# EasyEDA Pro project Modular-Analog-Synthesizer.eprj, schematic Schematic1
Board Name: sequencer; Create Date: 2026-03-14; Page Name: sequencer-circuit; Project Name: Modular-Analog-Synthesizer; Schematic Name: Schematic1; Update Date: 2026-04-13; Company: EasyEDA.com; Page Size: A4; Version: V1.0
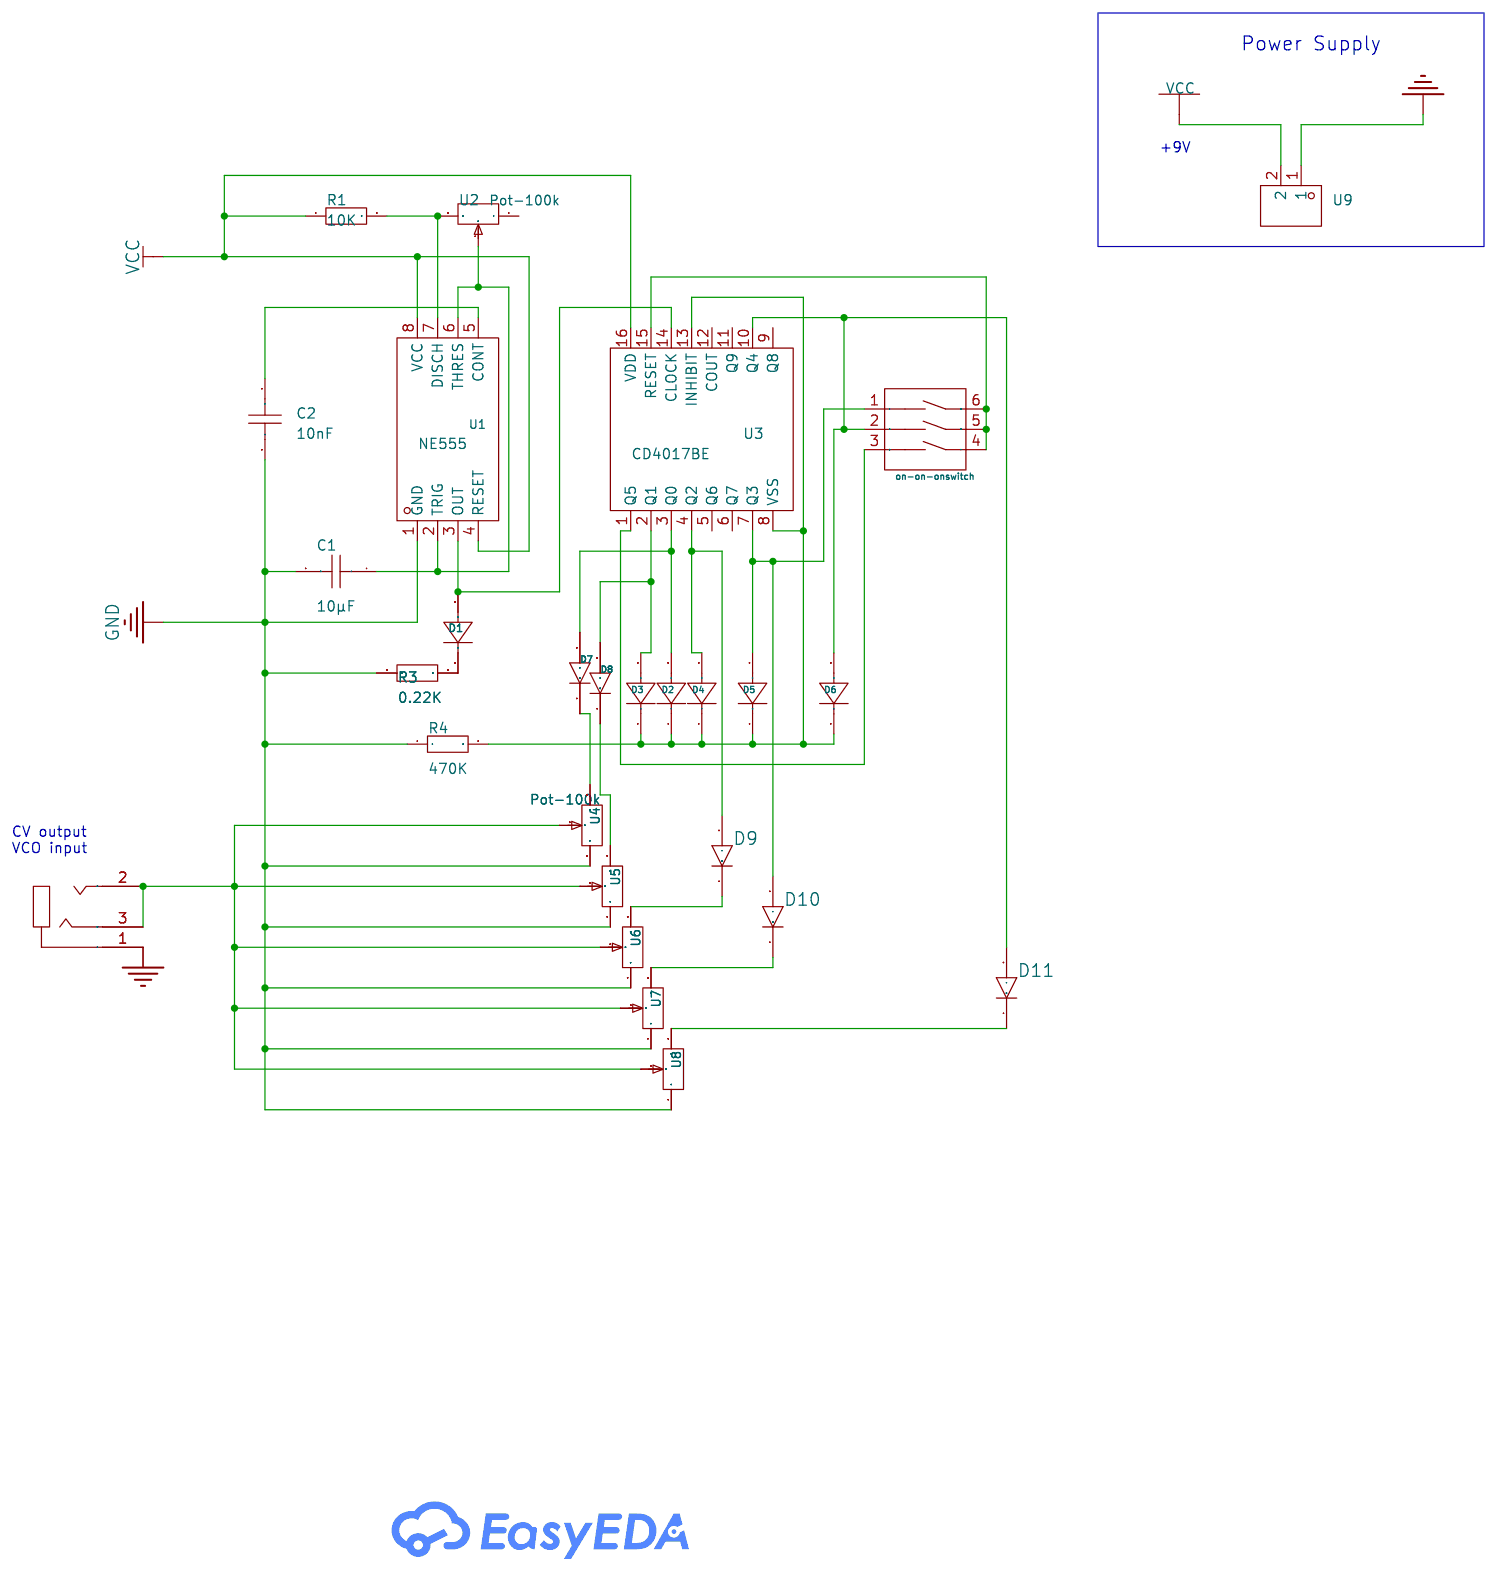
[diagram p0: schematic sheet]

## Parts
C1  10µF  [C0603]
C2  10nF  [C0603]
CVoutput  -  [AUDIO-SMD_PJ-313D]
D1  -  [SMA_L4.4-W2.8-LS5.4-RD]
D2  -  [SMA_L4.4-W2.8-LS5.4-RD]
D3  -  [SMA_L4.4-W2.8-LS5.4-RD]
D4  -  [SMA_L4.4-W2.8-LS5.4-RD]
D5  -  [SMA_L4.4-W2.8-LS5.4-RD]
D6  -  [SMA_L4.4-W2.8-LS5.4-RD]
D7  -  [DO-41_BD2.4-L4.7-P8.70-D0.9-RD]
D8  -  [DO-41_BD2.4-L4.7-P8.70-D0.9-RD]
D9  -  [DO-41_BD2.4-L4.7-P8.70-D0.9-RD]
D10  -  [DO-41_BD2.4-L4.7-P8.70-D0.9-RD]
D11  -  [DO-41_BD2.4-L4.7-P8.70-D0.9-RD]
on-on-onswitch  ATE2D-2M3-10-Z  [SW-TH_ATE2D-2M3-10-Z]
R1  10K  [R0603]
R3  0.22K  [R0603]
R4  470K  [R0603]
U1  NE555  [SOIC-8_L4.9-W3.9-P1.27-LS6.0-BL]
U2  Pot-100k  [RES-ADJ-SMD_VG039NCH]
U3  CD4017BE  [DIP-16_L19.2-W6.6-P2.54-LS7.6-BL]
U4  Pot-100k  [RES-ADJ-SMD_VG039NCH]
U5  Pot-100k  [RES-ADJ-SMD_VG039NCH]
U6  Pot-100k  [RES-ADJ-SMD_VG039NCH]
U7  Pot-100k  [RES-ADJ-SMD_VG039NCH]
U8  Pot-100k  [RES-ADJ-SMD_VG039NCH]
U9  -  [CONN-TH_P5.00_KF301-5.0-2P]

## Library data of the parts
C1 C2 = CAP_0603: Supplier Footprint: 0603
CVoutput = PJ-313D-6A: LCSC Part Name: 3.5mm耳机座; Supplier Part: C95463; Manufacturer: 韩国韩荣; Supplier Footprint: SMD; JLCPCB Part Class: Extended Part; Datasheet: https://atta.szlcsc.com/upload/public/pdf/source/20191118/C95463_33C76E25D98A90BB88D1795912C97EA2.pdf; Supplier: LCSC; Connector Type: 3.5mm耳机座; Current Rating (Max): 500mA; Voltage Rating (Max): 30V
D1-D6 = 1N4007: Supplier Footprint: SMA(DO-214AC); Supplier Part: C727081
D7-D11 = 1N4007: LCSC Part Name: 1kV 1A 1.1V@1A; Supplier Part: C84641; Manufacturer: 星海; Supplier Footprint: DO-41; JLCPCB Part Class: Extended Part; Datasheet: https://atta.szlcsc.com/upload/public/pdf/source/20171026/C84641_15089842760411059271.pdf; Supplier: LCSC; Forward Voltage (Vf@If): 1.1V@1A; Reverse Leakage Current: 5μA@1kV
on-on-onswitch = ATE2D-2M3-10-Z: LCSC Part Name: 拨动开关; Supplier Part: C2921532; Manufacturer: NIDEC(尼得科); Supplier Footprint: 插件,9.5x5mm; JLCPCB Part Class: Extended Part; Datasheet: https://item.szlcsc.com/datasheet/ATE2D-2M3-10-Z/3230384.html; Supplier: LCSC; Circuit: DPDT; Length: 9.5mm; Width: 5mm; Switch Height: 18mm; Life: 50,000 Cycles; Current Rating: 50mA; Voltage Rating (AC): 60V; Actuator Type: Cylinder Lever; Termination Style: Gull Wing; Mounting Type: Through Hole; Operating Temperature: -20℃~+85℃
R1 R3 R4 = Res_0603: Supplier Footprint: 0603
U1 = NE555_C5125085: Supplier Part: C5125085; Manufacturer: IDCHIP(英锐芯); Supplier Footprint: SOP-8; JLCPCB Part Class: Extended Part; Datasheet: https://item.szlcsc.com/datasheet/NE555/5722226.html; Supplier: LCSC
U2 U4-U8 = 3*3Potentiometer-10kΩ20%: Supplier Part: C9900010776; Supplier Footprint: SMD-3P; JLCPCB Part Class: Extended Part; Supplier: LCSC
U3 = CD4017BE: LCSC Part Name: 具有 10 个解码输出的 CMOS 十进制计数器; Supplier Part: C507168; Manufacturer: HGSEMI(华冠); Supplier Footprint: DIP-16; JLCPCB Part Class: Extended Part; Datasheet: https://item.szlcsc.com/datasheet/CD4017BE/520606.html; Supplier: LCSC; Voltage - Supply: 3V~18V; Trigger Type: Rising Edge; Reset: Asynchronous; Count Rate: 5.5MHz; Operating Temperature: -40℃~+85℃; Propagation Delay: 85ns
U9 = KF301-5.0-2P: LCSC Part Name: 5mm 排数:1 每排P数:2 直针 可拼接 铜 环保; Supplier Part: C474881; Manufacturer: KEFA(科发); Supplier Footprint: P=5mm; JLCPCB Part Class: Extended Part; Datasheet: https://atta.szlcsc.com/upload/public/pdf/source/20200115/C474881_883EFE2003339C40FD1BEEEFC9A18423.pdf; Supplier: LCSC; Pitch: 5mm; Number of Rows: 1; Number of PINs Per Row: 2; Mounting Style: 直针; Current Rating (Max): 17A; Voltage Rating (Max): 250V; Wire Gauge - AWG: 14~22; Wire Gauge - mm?: 1.5; Operating Temperature Range: -30℃~+120℃; Color: Blue

## Nets
GND: C1.2 C2.2 CVoutput.1 R3.1 R4.1 U1.1(GND) U4.1 U5.1 U6.1 U7.1 U8.1 U9.1
VCC: R1.1 U1.4(RESET) U1.8(VCC) U3.16(VDD) U9.2
$1N1040: D1.1(K) R3.2
$1N1543: D1.2(A) U1.3(OUT) U3.14(CLOCK)
$1N2347: D6.2(A) D11.2(A) on-on-onswitch.2 U3.10(Q4)
$1N2923: C1.1 U1.2(TRIG) U1.6(THRES) U2.2
$1N2927: R1.2 U1.7(DISCH) U2.3
$1N2930: C2.1 U1.5(CONT)
$1N4168: on-on-onswitch.3 U3.1(Q5)
$1N4634: on-on-onswitch.4 on-on-onswitch.5 on-on-onswitch.6 U3.15(RESET)
$1N5515: CVoutput.2 CVoutput.3 U4.2 U5.2 U6.2 U7.2 U8.2
$1N6043: D7.1(C) U4.3
$1N6049: D2.2(A) D7.2(A) U3.3(Q0)
$1N6089: D8.1(C) U5.3
$1N6096: D3.2(A) D8.2(A) U3.2(Q1)
$1N6135: D9.1(C) U6.3
$1N6142: D4.2(A) D9.2(A) U3.4(Q2)
$1N6181: D10.1(C) U7.3
$1N6228: D11.1(C) U8.3
$1N6339: D5.2(A) D10.2(A) on-on-onswitch.1 U3.7(Q3)
$1N6469: D2.1(K) D3.1(K) D4.1(K) D5.1(K) D6.1(K) R4.2 U3.8(VSS) U3.13(INHIBIT)

Not connected (* = marked no-connect by the designer): U2 1; U3 5(Q6) 6(Q7) 9(Q8) 11(Q9) 12(COUT)

## Notes on the sheet
- Power Supply
- +9V
- CV output
  VCO input
